# Altium project RFID_DACS-01.PrjPcb (part 3 of 3)

## Sheet 1.POWER.SchDoc: POWER
size A3; DrawnBy: AYTAC DILEK; SheetNumber: 1; SheetTotal: 16
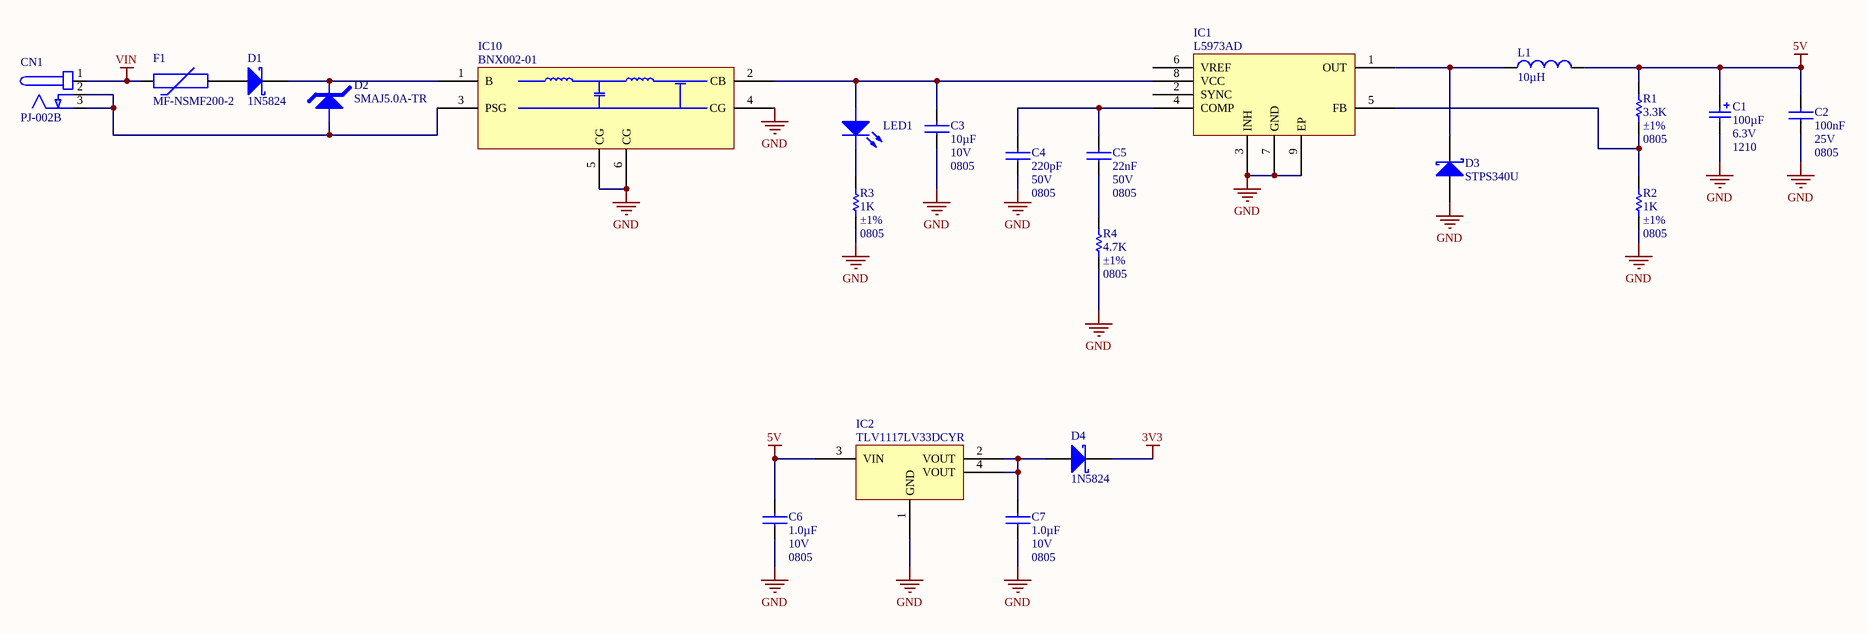
[diagram p10: 1.POWER.SchDoc]

### Parts
C1  Capacitance: 100µF  Voltage - Rated: 6.3V  Package / Case: 1210  [CAPMP3528X19N_EIA-1210_CASE-B]  (hidden comment: CAP_P)
C2  Capacitance: 100nF  Voltage - Rated: 25V  Package / Case: 0805  [CAPC2012X100N_EIA0805]  (hidden comment: CAP_NP)
C3  Capacitance: 10µF  Voltage - Rated: 10V  Package / Case: 0805  [CAPC2012X100N_EIA0805]  (hidden comment: CAP_NP)
C4  Capacitance: 220pF  Voltage - Rated: 50V  Package / Case: 0805  [CAPC2012X100N_EIA0805]  (hidden comment: CAP_NP)
C5  Capacitance: 22nF  Voltage - Rated: 50V  Package / Case: 0805  [CAPC2012X100N_EIA0805]  (hidden comment: CAP_NP)
C6  Capacitance: 1.0µF  Voltage - Rated: 10V  Package / Case: 0805  [CAPC2012X100N_EIA0805]  (hidden comment: CAP_NP)
C7  Capacitance: 1.0µF  Voltage - Rated: 10V  Package / Case: 0805  [CAPC2012X100N_EIA0805]  (hidden comment: CAP_NP)
CN1  Manufacturer Part Number: PJ-002B  [DC_JACK]  (hidden comment: DC_JACK)
D1  value 1N5824  [DIOM4436X24N_DO-214AA_SMB]  (hidden comment: DIODE_SCHOTTKY)
D2  value SMAJ5.0A-TR  [DIOM5126X26N_DO-214AC_SMA]  (hidden comment: DIODE_TVS_UNI)
D3  value STPS340U  [DIOM4436X24N_DO-214AA_SMB]  (hidden comment: DIODE_SCHOTTKY)
D4  value 1N5824  [DIOM4436X24N_DO-214AA_SMB]  (hidden comment: DIODE_SCHOTTKY)
F1  Manufacturer Part Number: MF-NSMF200-2  [FUSEC3216X16N]  (hidden comment: PTC)
IC1  L5973AD  [SOP127P600X200_HS-9N]
IC2  TLV1117LV33DCYR  [SOT230P700X180-4N_[TEXAS]R-PDSO-G4]
IC10  BNX002-01  [MURATA_BNX002-01]
L1  value 10µH  [TDK_SLF10145T-100M2R5-PF]  (hidden comment: INDUCTOR)
LED1  LED  [LEDC2012X70N_EIA0805_GREEN]  (value not drawn)
R1  value 3.3K  Tolerance: ±1%  Package / Case: 0805  [RESC2013X65N_EIA0805]  (hidden comment: RES)
R2  value 1K  Tolerance: ±1%  Package / Case: 0805  [RESC2013X65N_EIA0805]  (hidden comment: RES)
R3  value 1K  Tolerance: ±1%  Package / Case: 0805  [RESC2013X65N_EIA0805]  (hidden comment: RES)
R4  value 4.7K  Tolerance: ±1%  Package / Case: 0805  [RESC2013X65N_EIA0805]  (hidden comment: RES)

### Nets
3V3: D4.1
5V: C1.1 C2.2 C6.2 IC2.3(VIN) L1.2 R1.1
GND: C1.2 C2.1 C3.1 C4.1 C6.1 C7.1 D3.2 IC1.3(INH) IC1.7(GND) IC1.9(EP) IC2.1(GND) IC10.4(CG) IC10.5(CG) IC10.6(CG) R2.2 R3.2 R4.2
VIN: CN1.1(+) F1.1
NetC3_2: C3.2 IC1.8(VCC) IC10.2(CB) LED1.2
NetC4_2: C4.2 C5.2 IC1.4(COMP)
NetC5_1: C5.1 R4.1
NetC7_2: C7.2 D4.2 IC2.2(VOUT) IC2.4(VOUT)
NetCN1_2: CN1.2(GND) CN1.3(GND) D2.2 IC10.3(PSG)
NetD1_1: D1.1 D2.1 IC10.1(B)
NetD1_2: D1.2 F1.2
NetD3_1: D3.1 IC1.1(OUT) L1.1
NetIC1_5: IC1.5(FB) R1.2 R2.1
NetLED1_1: LED1.1 R3.1

Not connected (* = marked no-connect by the designer): IC1 2(SYNC) 6(VREF)

### Library data of the parts
C1 = SCAP01400007: CAP TANT 100UF 6.3V 20% 1210; Manufacturer: AVX Corporation; Manufacturer Part Number: TAJB107M006RNJ; ESR (Equivalent Series Resistance): 1.7 Ohm; Type: Molded; Cost x1 ($): 1.25000; Cost x10 ($): 1.02500; Cost x100 ($): 0.72500; Cost x1000 ($): 0.47500; Distrubutor: Digikey; Part Number: SCAP01400007; Value: 100uF; Tolerance: ±20%; Operating Temperature: -55°C ~ 125°C; Category: Capacitors; Family: Tantalum Capacitors; Distributor Part Number: 478-3877-1-ND; Distributor Link: http://www.digikey.com/product-detail/en/TAJB107M006RNJ/478-3877-1-ND/1126923; ROHS: YES; Quantity: 10
C2 = SCAP00300093: CAP CER 0.1UF 25V X7R 0805; Manufacturer: Samsung Electro-Mechanics America, Inc.; Manufacturer Part Number: CL21B104KACNNNC; Value: 100nF; Tolerance: ±10%; Type: Multi Layer Ceramic Capacitor  (MLCC); Cost x1 ($): 0.10000; Cost x10 ($): 0.03300; Cost x100 ($): 0.01470; Cost x1000 ($): 0.00825; Distrubutor: Digikey; Lead Time: 11 Weeks; Part Number: SCAP00300093; Temperature Coefficient: X7R; Operating Temperature: -55°C ~ 125°C; Mounting Type: Surface Mount, MLCC; Size / Dimension: 0.079" L x 0.049" W (2.00mm x 1.25mm); Category: Capacitors; Family: Ceramic Capacitors; Distributor Part Number: 1276-1099-1-ND; Distributor Link: http://www.digikey.com/product-detail/en/samsung-electro-mechanics-america-inc/CL21B104KACNNNC/1276-1099-1-ND/3889185; ROHS: YES; Moisture Sensitivity Level (MSL): 1 (Unlimited); Quantity: 50
C3 = SCAP00300106: CAP CER 10UF 10V X5R 0805; Manufacturer: Samsung Electro-Mechanics America, Inc; Manufacturer Part Number: CL21A106KPFNNNE; Tolerance: ±10%; Type: Multi Layer Ceramic Capacitor  (MLCC); Cost x1 ($): 0.18000; Cost x10 ($): 0.13000; Cost x100 ($): 0.06090; Cost x1000 ($): 0.03535; Distrubutor: Digikey; Lead Time: 11 Weeks; Part Number: SCAP00300106; Value: 10uF; Temperature Coefficient: X5R; Operating Temperature: -55°C ~ 85°C; Mounting Type: Surface Mount, MLCC; Size / Dimension: 0.079" L x 0.049" W (2.00mm x 1.25mm); Category: Capacitors; Family: Ceramic Capacitors; Distributor Part Number: 1276-1052-1-ND; Distributor Link: http://www.digikey.com/product-detail/en/samsung-electro-mechanics-america-inc/CL21A106KPFNNNE/1276-1052-1-ND/3889138; ROHS: YES; Moisture Sensitivity Level (MSL): 1 (Unlimited); Quantity: 50
C4 = SCAP00300066: CAP CER 220PF 50V X7R 0805; Manufacturer: Samsung Electro-Mechanics America, Inc.; Manufacturer Part Number: CL21B221KBANNNC; Tolerance: ±10%; Type: Multi Layer Ceramic Capacitor  (MLCC); Cost x1 ($): 0.10000; Cost x10 ($): 0.04700; Cost x100 ($): 0.02100; Cost x1000 ($): 0.01180; Distrubutor: Digikey; Lead Time: 11 Weeks; Part Number: SCAP00300066; Value: 220pF; Temperature Coefficient: X7R; Operating Temperature: -55°C ~ 125°C; Mounting Type: Surface Mount, MLCC; Size / Dimension: 0.079" L x 0.049" W (2.00mm x 1.25mm); Category: Capacitors; Family: Ceramic Capacitors; Distributor Part Number: 1276-2474-1-ND; Distributor Link: http://www.digikey.com/product-detail/en/samsung-electro-mechanics-america-inc/CL21B221KBANNNC/1276-2474-1-ND/3890560; ROHS: YES; Moisture Sensitivity Level (MSL): 1 (Unlimited); Quantity: 50
C5 = SCAP00300087: CAP CER 0.022UF 50V X7R 0805; Manufacturer: Samsung Electro-Mechanics America, Inc.; Manufacturer Part Number: CL21B223KBANNNC; Value: 22nF; Tolerance: ±10%; Type: Multi Layer Ceramic Capacitor  (MLCC); Cost x1 ($): 0.10000; Cost x10 ($): 0.05800; Cost x100 ($): 0.02600; Cost x1000 ($): 0.01458; Distrubutor: Digikey; Lead Time: 11 Weeks; Part Number: SCAP00300087; Temperature Coefficient: X7R; Operating Temperature: -55°C ~ 125°C; Mounting Type: Surface Mount, MLCC; Size / Dimension: 0.079" L x 0.049" W (2.00mm x 1.25mm); Category: Capacitors; Family: Ceramic Capacitors; Distributor Part Number: 1276-1081-1-ND; Distributor Link: http://www.digikey.com/product-detail/en/samsung-electro-mechanics-america-inc/CL21B223KBANNNC/1276-1081-1-ND/3889167; ROHS: YES; Moisture Sensitivity Level (MSL): 1 (Unlimited); Quantity: 50
C6 C7 = SCAP00300099: CAP CER 1UF 10V X7R 0805; Manufacturer: Samsung Electro-Mechanics America, Inc.; Manufacturer Part Number: CL21B105KPFNNNE; Value: 1.0uF; Tolerance: ±10%; Type: Multi Layer Ceramic Capacitor  (MLCC); Cost x1 ($): 0.10000; Cost x10 ($): 0.06100; Cost x100 ($): 0.02700; Cost x1000 ($): 0.01513; Distrubutor: Digikey; Lead Time: 11 Weeks; Part Number: SCAP00300099; Temperature Coefficient: X7R; Operating Temperature: -55°C ~ 125°C; Mounting Type: Surface Mount, MLCC; Size / Dimension: 0.079" L x 0.049" W (2.00mm x 1.25mm); Category: Capacitors; Family: Ceramic Capacitors; Distributor Part Number: 1276-1275-1-ND; Distributor Link: http://www.digikey.com/product-detail/en/samsung-electro-mechanics-america-inc/CL21B105KPFNNNE/1276-1275-1-ND/3889361; ROHS: YES; Moisture Sensitivity Level (MSL): 1 (Unlimited); Quantity: 50
CN1 = SCON00027: CONN POWER JACK MALE 2.5MM CLSD; Manufacturer: CUI Inc; Voltage: 24VDC; Current: 2.5A; Distrubutor: Digikey; Lead Time: 10 Weeks; Cost x1 ($): 0.93000; Cost x10 ($): 0.65100; Cost x100 ($): 0.43710; Cost x1000 ($): 0.31620; Part Number: SCON00027; Value: DC_JACK; Category: Connectors, Interconnects; Family: Barrel - Power Connectors; Connector Type: Jack; Contact Type: Male; Mounting Type: Through Hole, Right Angle; Packaging: Bulk; Contact Finish: Silver; Distributor Part Number: CP-002B-ND; Datasheet Link: http://www.digikey.com/product-detail/en/PJ-002B/CP-002B-ND/96965; ROHS: YES; Moisture Sensitivity Level (MSL): 1 (Unlimited); Part Status: Active; Quantity: 20
D1 D4 = SSEM00019: DIODE SCHOTTKY 5A 40V SMA; Manufacturer: Micro Commercial Co; Manufacturer Part Number: SK54B-LTP; Distrubutor: Digikey; Lead Time: 1 (Unlimited); Cost x10 ($): 0.42000; Cost x100 ($): 0.28840; Cost x1000 ($): 0.14832; Cost x1 ($): 0.54000; Part Number: SSEM00019; Category: Discrete Semiconductor Products; Family: Diodes - Rectifiers - Single; Package / Case: DO-214AA, SMB; Type: Schottky; Distributor Part Number: SK54B-LTPMSCT-ND; ROHS: YES; Datasheet Link: http://www.digikey.com/product-detail/en/micro-commercial-co/SK54B-LTP/SK54B-LTPMSCT-ND/5865087; Moisture Sensitivity Level (MSL): 8 Weeks; Quantity: 0
D2 = SCP00004: TVS DIODE 5VWM 13.4VC DO214AC; Manufacturer: STMicroelectronics; Voltage - Reverse Standoff (Typ): 5V; Voltage - Breakdown (Min): 6.4V; Power - Peak Pulse: 400W; Type: Zener; Cost x10 ($): 0.29600; Cost x100 ($): 0.18420; Cost x1000 ($): 0.09682; Distrubutor: Digikey; Lead Time: 11 Weeks; Cost x1 ($): 0.39000; Part Number: SCP00004; Category: Circuit Protection; Family: TVS - Diodes; Package / Case: DO-214AC, SMA; Manufacturer Part Number: SMAJ5.0A-TR; Distributor Part Number: 497-2999-1-ND; ROHS: YES; Datasheet Link: http://www.digikey.com/product-detail/en/stmicroelectronics/SMAJ5.0A-TR/497-2999-1-ND/634866; Moisture Sensitivity Level (MSL): 1 (Unlimited); Quantity: 0
D3 = SSEM00020: DIODE SCHOTTKY 40V 3A SMB; Manufacturer: STMicroelectronics; Cost x10 ($): 0.39500; Cost x100 ($): 0.29480; Cost x1000 ($): 0.17850; Distrubutor: Digikey; Lead Time: 1 (Unlimited); Cost x1 ($): 0.46000; Part Number: SSEM00020; Category: Discrete Semiconductor Products; Family: Diodes - Rectifiers - Single; Package / Case: DO-214AA, SMB; Type: Schottky; Manufacturer Part Number: STPS340U; Distributor Part Number: 497-2465-1-ND; ROHS: YES; Datasheet Link: http://www.digikey.com/product-detail/en/stmicroelectronics/STPS340U/497-2465-1-ND/603847; Part Status: Active; Quantity: 0
F1 = SCP00008: FUSE RESETTABLE 2.0A HOLD SMD; Manufacturer: Bourns Inc.; Value: MF-NSMF200-2; Cost x10 ($): 0.56100; Cost x100 ($): 0.39270; Cost x1000 ($): 0.26690; Distrubutor: Digikey; Lead Time: 10 Weeks; Cost x1 ($): 0.60000; Part Number: SCP00008; Category: Circuit Protection; Family: PTC Resettable Fuses; Package / Case: 1206 (3216 Metric), Concave, Long Side Terminals; Distributor Part Number: MF-NSMF200-2CT-ND; ROHS: YES; Datasheet Link: http://www.digikey.com/product-detail/en/bourns-inc/MF-NSMF200-2/MF-NSMF200-2CT-ND/1232791; Moisture Sensitivity Level (MSL): 1 (Unlimited); Quantity: 100; Part Status: Active
IC1 = SIC00116: IC REG BUCK ADJ 2A 8SOIC; Manufacturer: STMicroelectronics; Vin: 4 V ~ 36 V; Speed: 500kHz; Cost x10 ($): 1.98800; Cost x100 ($): 1.59750; Cost x1000 ($): 1.08750; Distrubutor: Digikey; Lead Time: 12 Weeks; Cost x1 ($): 2.21000; Part Number: SIC00116; Manufacturer Part Number: L5973AD; Value: L5973AD; Iout: 2A; Operating Temperature: -40°C ~ 150°C (TJ); Category: Integrated Circuits (ICs); Family: PMIC - Voltage Regulators - DC DC Switching Regulators; Package / Case: 8-SOIC (0.154", 3.90mm Width) Exposed Pad; Type: Buck; Distributor Part Number: 497-4565-5-ND; ROHS: YES; Distributor Link: http://www.digikey.com/product-detail/en/stmicroelectronics/L5973AD/497-4565-5-ND/585938; MSL: 3 (168 Hours); Quantity: 0
IC2 = SIC00137: IC REG LDO 3.3V 1A SOT223; Manufacturer: Texas Instruments; Vin: Up to 5.5V; Iout: 1.1A; Cost x10 ($): 0.56400; Cost x100 ($): 0.43160; Cost x1000 ($): 0.27390; Distrubutor: Digikey; Lead Time: 6 Weeks; Cost x1 ($): 0.64000; Part Number: SIC00137; Manufacturer Part Number: TLV1117LV33DCYR; Value: TLV1117LV33DCYR; Vout: 3.3V; Operating Temperature: -40°C ~ 125°C; Category: Integrated Circuits (ICs); Family: PMIC - Voltage Regulators - Linear; Package / Case: SOT-223-4, TO-261-4, TO-261AA; Type: Positive Fixed; Distributor Part Number: 296-28778-1-ND; ROHS: YES; Distributor Link: http://www.digikey.com/product-detail/en/texas-instruments/TLV1117LV33DCYR/296-28778-1-ND/2666520; MSL: 1 (Unlimited); Quantity: 0
IC10 = SFIL00006: FILTER LC TH; Manufacturer: Murata Electronics North America; Current Rating: 10A; Value: LC_FILTER; Cost x10 ($): 7.62800; Cost x100 ($): 4.91550; Cost x1000 ($): 4.23750; Distrubutor: Digikey; Lead Time: 7 Weeks; Cost x1 ($): 8.48000; Part Number: SFIL00006; Type: Low Pass; Package / Case: Block, 4 Lead; Category: Filters; Family: EMI/RFI Filters (LC, RC Networks); Manufacturer Part Number: BNX002-01; Distributor Part Number: 490-5053-ND; ROHS: YES; Datasheet Link: http://www.digikey.com/product-detail/en/murata-electronics-north-america/BNX002-01/490-5053-ND/1825574; Quantity: 0
L1 = SIND00006: FIXED IND 10UH 2.5A 43.7 MOHM; Manufacturer: TDK Corporation; Manufacturer Part Number: SLF10145T-100M2R5-PF; Tolerance: ±20%; DC Resistance (DCR): 43.7 mOhm Max; Type: Wirewound; Cost x10 ($): 1.12500; Cost x100 ($): 0.85500; Distrubutor: Digikey; Lead Time: 14 Weeks; Cost x1 ($): 1.20000; Part Number: SIND00006; Inductance: 10µH; Package / Case: Nonstandard; Operating Temperature: -40°C ~ 105°C; Current Rating: 2.5A; Category: Inductors, Coils, Chokes; Family: Fixed Inductors; Cost x1000 ($): 0.85500; Distributor Part Number: 445-1975-1-ND; Distributor Link: http://www.digikey.com/product-detail/en/tdk-corporation/SLF10145T-100M2R5-PF/445-1975-1-ND/755382; ROHS: YES; Moisture Sensitivity Level (MSL): 1 (Unlimited); Quantity: 0
LED1 = SOPT00002: LED GREEN CLEAR THIN 0805 SMD; Manufacturer: Lite-On Inc; Manufacturer Part Number: LTST-C171KGKT; Value: LED_GREEN; Cost x10 ($): 0.24800; Cost x100 ($): 0.13500; Cost x1000 ($): 0.05850; Distrubutor: Digikey; Cost x1 ($): 0.32000; Part Number: SOPT00002; Package / Case: 0805 (2012 Metric); Category: Optoelectronics; Family: LED Indication - Discrete; Type: LED; Distributor Part Number: 160-1426-1-ND; ROHS: YES; Datasheet Link: http://www.digikey.com/product-detail/en/LTST-C171KGKT/160-1426-1-ND/386798; Quantity: 124
R1 = SRES03010086: RES SMD 3.3K OHM 1% 1/8W 0805; Manufacturer: Yageo; Manufacturer Part Number: RC0805FR-073K3L; Power (Watts): 0.125W, 1/8W; Cost x1 ($): 0.10; Cost x10 ($): 0.21; Cost x100 ($): 0.84; Cost x1000 ($): 3.79; Distrubutor: Digikey; Part Number: SRES03010086; Resistance (Ohm): 3.3K; Category: Resistors; Family: Chip Resistor - Surface Mount; Distributor Part Number: 311-3.30KCRCT-ND; Distributor Link: http://www.digikey.com/product-detail/en/RC0805FR-073K3L/311-3.30KCRCT-ND/730760; ROHS: YES; Quantity: 0
R2 R3 = SRES03010074: RES SMD 1K OHM 1% 1/8W 0805; Manufacturer: Yageo; Manufacturer Part Number: RC0805FR-071KL; Power (Watts): 0.125W, 1/8W; Cost x1 ($): 0.10; Cost x10 ($): 0.21; Cost x100 ($): 0.84; Cost x1000 ($): 3.79; Distrubutor: Digikey; Part Number: SRES03010074; Resistance (Ohm): 1K; Category: Resistors; Family: Chip Resistor - Surface Mount; Distributor Part Number: 311-1.00KCRCT-ND; Distributor Link: http://www.digikey.com/product-detail/en/RC0805FR-071KL/311-1.00KCRCT-ND/730391; ROHS: YES; Quantity: 0
R4 = SRES03010090: RES SMD 4.7K OHM 1% 1/8W 0805; Manufacturer: Yageo; Manufacturer Part Number: RC0805FR-074K7L; Power (Watts): 0.125W, 1/8W; Cost x1 ($): 0.10; Cost x10 ($): 0.21; Cost x100 ($): 0.84; Cost x1000 ($): 3.79; Distrubutor: Digikey; Part Number: SRES03010090; Resistance (Ohm): 4.7K; Category: Resistors; Family: Chip Resistor - Surface Mount; Distributor Part Number: 311-4.70KCRCT-ND; Distributor Link: http://www.digikey.com/product-detail/en/RC0805FR-074K7L/311-4.70KCRCT-ND/730876; ROHS: YES; Quantity: 0

## Sheet 10.RELAY.SchDoc: RELAY
size A; SheetNumber: 10; SheetTotal: 16
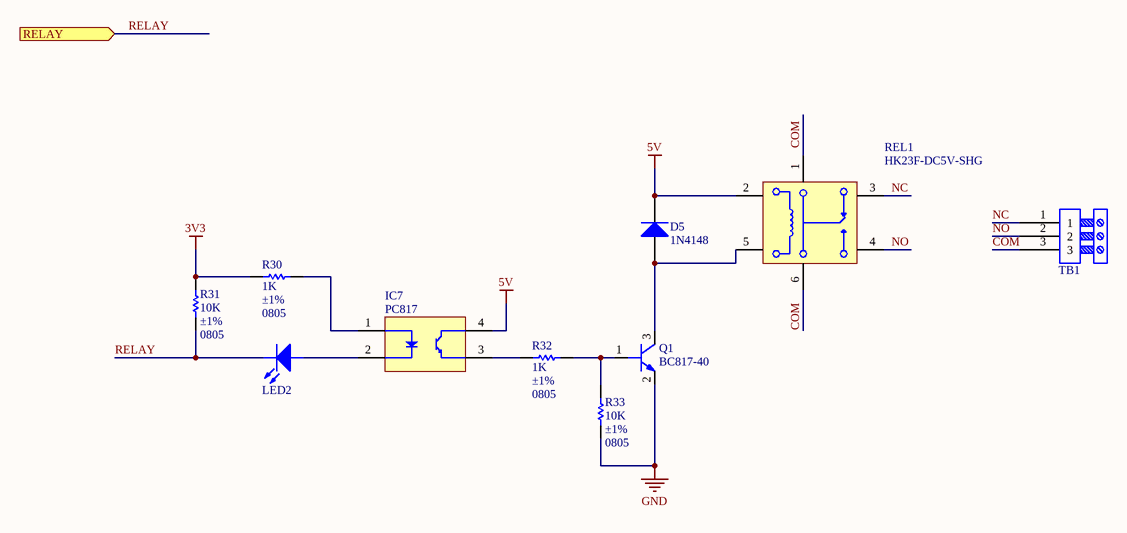
[diagram p11: 10.RELAY.SchDoc]

### Parts
D5  value 1N4148  [SOD323]  (hidden comment: DIODE)
IC7  PC817  [SMD-4]
LED2  LED  [LEDC2012X70N_EIA0805_RED]  (value not drawn)
Q1  value BC817-40  [SOT95P230X110-3N_SOT-23]  (hidden comment: BC817)
R30  value 1K  Tolerance: ±1%  Package / Case: 0805  [RESC2013X65N_EIA0805]  (hidden comment: RES)
R31  value 10K  Tolerance: ±1%  Package / Case: 0805  [RESC2013X65N_EIA0805]  (hidden comment: RES)
R32  value 1K  Tolerance: ±1%  Package / Case: 0805  [RESC2013X65N_EIA0805]  (hidden comment: RES)
R33  value 10K  Tolerance: ±1%  Package / Case: 0805  [RESC2013X65N_EIA0805]  (hidden comment: RES)
REL1  HK23F-DC5V-SHG  [HUIKE_HK23F-DC5V-SHG]
TB1  TB3_EURO  [TB3_EURO]  (value not drawn)

### Ports
RELAY (in)

### Nets
3V3: R30.1 R31.1
5V: D5.1(K) IC7.4 REL1.2
GND: Q1.2(E) R33.2
COM: REL1.1 REL1.6 TB1.3
NC: REL1.3 TB1.1
NO: REL1.4 TB1.2
RELAY: LED2.1 R31.2 ; port RELAY
NetD5_2: D5.2(A) Q1.3(C) REL1.5
NetIC7_1: IC7.1 R30.2
NetIC7_2: IC7.2 LED2.2
NetIC7_3: IC7.3 R32.2
NetQ1_1: Q1.1(B) R32.1 R33.1

### Library data of the parts
D5 = SSEM00021: DIODE GEN PURP 75V 150MA SOD323; Manufacturer: Diodes Incorporated; Manufacturer Part Number: 1N4148WS-7-F; Type: Standard; Cost x10 ($): 0.15500; Cost x100 ($): 0.08480; Cost x1000 ($): 0.03554; Distrubutor: Digikey; Lead Time: 1 (Unlimited); Cost x1 ($): 0.17000; Part Number: SSEM00021; Voltage: 75V; Category: Discrete Semiconductor Products; Family: Diodes - Rectifiers - Single; Package / Case: SC-76, SOD-323; Distributor Part Number: 1N4148WS-FDICT-ND; ROHS: YES; Datasheet Link: http://www.digikey.com/product-detail/en/diodes-incorporated/1N4148WS-7-F/1N4148WS-FDICT-ND/815281; Moisture Sensitivity Level (MSL): 6 Weeks; Part Status: Active; Quantity: 0
IC7 = SISO00004: OPTOISOLTR 5KV TRANSISTOR 4-SMD; Manufacturer: Everlight Electronics Co Ltd; Manufacturer Part Number: EL817(S)(C)(TD)-G; Voltage - Isolation: 5000Vrms; Cost x10 ($): 0.11100; Distrubutor: Digikey; Lead Time: 12 Weeks; Part Number: SISO00004; Value: PC817; Category: Isolators; Family: Optoisolators - Transistor, Photovoltaic Output; Package / Case: 4-SMD, Gull Wing; Type: General Purpose; Cost x100 ($): 0.11100; Cost x1000 ($): 0.11100; Distributor Part Number: EL817(S)(C)(TD)-G-ND; ROHS: YES; Distributor Link: http://www.digikey.com/product-detail/en/everlight-electronics-co-ltd/EL817(S)(C)(TD)-G/EL817(S)(C)(TD)-G-ND/2693421; Quantity: 0; Cost x1 ($): 0.11100
LED2 = SOPT00004: LED SUPER RED CLR THIN 0805 SMD; Manufacturer: Lite-On Inc; Manufacturer Part Number: LTST-C171KRKT; Value: LED_RED; Cost x10 ($): 0.24800; Cost x100 ($): 0.13500; Cost x1000 ($): 0.05850; Distrubutor: Digikey; Cost x1 ($): 0.32000; Part Number: SOPT00004; Package / Case: 0805 (2012 Metric); Category: Optoelectronics; Family: LED Indication - Discrete; Type: LED; Distributor Part Number: 160-1427-1-ND; ROHS: YES; Datasheet Link: http://www.digikey.com/product-detail/en/LTST-C171KRKT/160-1427-1-ND/386800; Quantity: 110
Q1 = STRANS00034: TRANS NPN 45V 0.5A SOT23; Manufacturer: NXP Semiconductors; Manufacturer Part Number: BC817-40,215; Ic (Max): 500mA; Vce Saturation (Max) @ Ib, Ic: 700mV @ 50mA, 500mA; Ic Cutoff (Max): 100nA (ICBO); hFE (Min) @ Ic, Vce: 250 @ 100mA, 1V; Power - Max: 250mW; Frequency - Transition: 100MHz; Cost x10 ($): 0.12700; Cost x100 ($): 0.06930; Cost x1000 ($): 0.02905; Distrubutor: Digikey; Lead Time: 6 Weeks; Cost x1 ($): 0.14000; Part Number: STRANS00034; Vce Breakdown (Max): 45V; Mounting Type: SMD; Category: Discrete Semiconductor Products; Family: Transistors (BJT) - Single; Transistor Type: NPN; Package / Case: SOT-23-3, TO-236-3, SC-59; Distributor Part Number: 568-1631-1-ND; ROHS: YES; Datasheet Link: http://www.digikey.com/product-detail/en/nxp-semiconductors/BC817-40,215/568-1631-1-ND/763458; Quantity: 110
R30 R32 = SRES03010074: as R2 on sheet 1.POWER; Part Number: SRES03010074; Resistance (Ohm): 1K; Category: Resistors; Family: Chip Resistor - Surface Mount; Distributor Part Number: 311-1.00KCRCT-ND; Distributor Link: http://www.digikey.com/product-detail/en/RC0805FR-071KL/311-1.00KCRCT-ND/730391; ROHS: YES; Quantity: 0
R31 R33 = SRES03010098: RES SMD 10K OHM 1% 1/8W 0805; Manufacturer: Yageo; Manufacturer Part Number: RC0805FR-0710KL; Power (Watts): 0.125W, 1/8W; Cost x1 ($): 0.10; Cost x10 ($): 0.21; Cost x100 ($): 0.84; Cost x1000 ($): 3.79; Distrubutor: Digikey; Part Number: SRES03010098; Resistance (Ohm): 10K; Category: Resistors; Family: Chip Resistor - Surface Mount; Distributor Part Number: 311-10.0KCRCT-ND; Distributor Link: http://www.digikey.com/product-detail/en/RC0805FR-0710KL/311-10.0KCRCT-ND/730482; ROHS: YES; Quantity: 0
REL1 = SREL00004: RELAY GEN PURPOSE SPDT 3A 5V; Coil Voltage: 5VDC; Contact Rating (Current): 2A@120VAC/2A@24VDC; Contact Form: SPDT (1 Form C); Part Number: SREL00004; Value: HK23F-DC5V-SHG; Operating Temperature: -30°C ~ 70°C; Type: General Purpose; Category: Relays; Family: Signal Relays, Up to 3 Amps; Mounting Type: Through Hole
TB1 = SCON00134: TERM BLOCK HDR 3POS VERT 3.81MM; Manufacturer: On Shore Technology Inc.; Manufacturer Part Number: EDSTLZ1550/3; Value: TB3-HDR; Pitch: 0.150" (3.81mm); Connector Type: Header, Male Pins, Shrouded (4 Side); Cost x1 ($): 1.15000; Cost x10 ($): 1.01000; Cost x100 ($): 0.87120; Cost x1000 ($): 0.63360; Distrubutor: Digikey; Lead Time: 8 Weeks; Part Number: SCON00134; Category: Connectors, Interconnects; Family: Terminal Blocks - Headers, Plugs and Sockets; Mounting Type: Through Hole; Distributor Part Number: ED1935-ND; Datasheet Link: http://www.digikey.com/product-detail/en/on-shore-technology-inc/EDSTLZ1550-3/ED1935-ND/250542; ROHS: YES; Moisture Sensitivity Level (MSL): 1 (Unlimited); Part Status: Active; Quantity: 0

## Sheet 14.BUZZER.SchDoc: BUZZER
size A; SheetNumber: 14; SheetTotal: 16
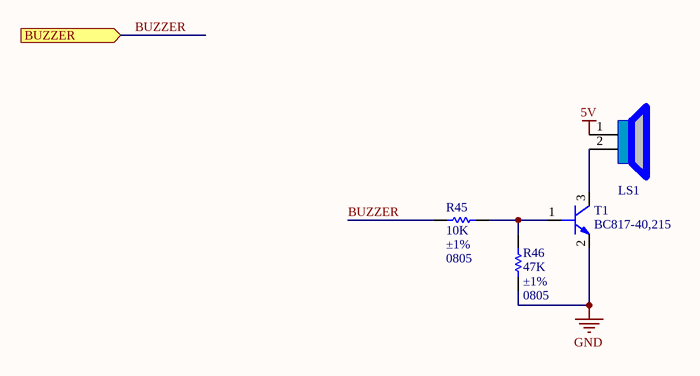
[diagram p12: 14.BUZZER.SchDoc]

### Parts
LS1  BUZZER  [BUZZER_12MM]  (value not drawn)
R45  Resistance (Ohm): 10K  Tolerance: ±1%  Package / Case: 0805  [RESC2013X65N_EIA0805]  (hidden comment: RES)
R46  Resistance (Ohm): 47K  Tolerance: ±1%  Package / Case: 0805  [RESC2013X65N_EIA0805]  (hidden comment: RES)
T1  Manufacturer Part Number: BC817-40,215  [SOT95P240X120-3N_SOT-23-3]  (hidden comment: BC817-40)

### Ports
BUZZER (in)

### Nets
5V: LS1.1(+)
GND: R46.1 T1.2(E)
BUZZER: R45.1 ; port BUZZER
NetLS1_2: LS1.2(-) T1.3(C)
NetR45_2: R45.2 R46.2 T1.1(B)

### Library data of the parts
LS1 = SAUD00001: AUDIO MAGNETIC INDICATOR 4-7V TH; Manufacturer: CUI Inc.; Manufacturer Part Number: CEM-1205C; Voltage: 5VDC; Iin: 35mA; Frequency: 2.3kHz; Cost x10 ($): 2.08200; Cost x100 ($): 1.54200; Cost x1000 ($): 1.11795; Distrubutor: Digikey; Lead Time: 13 Weeks; Cost x1 ($): 2.51000; Part Number: SAUD00001; Value: BUZZER; Size / Dimension: 12.0mm Dia x 10.0mm H; Category: Audio Products; Family: Buzzers; Type: Indicator, Internally Driven; Distributor Part Number: 102-1124-ND; ROHS: YES; Datasheet Link: http://www.digikey.com/product-detail/en/cui-inc/CEM-1205C/102-1124-ND/412383; Moisture Sensitivity Level (MSL): 1 (Unlimited); Quantity: 20; Active: Active
R45 = SRES03010098: as R31 on sheet 10.RELAY; Part Number: SRES03010098; Value: 10K; Category: Resistors; Family: Chip Resistor - Surface Mount; Distributor Part Number: 311-10.0KCRCT-ND; Distributor Link: http://www.digikey.com/product-detail/en/RC0805FR-0710KL/311-10.0KCRCT-ND/730482; ROHS: YES; Quantity: 0
R46 = SRES03010114: RES SMD 47K OHM 1% 1/8W 0805; Manufacturer: Yageo; Manufacturer Part Number: RC0805FR-0747KL; Power (Watts): 0.125W, 1/8W; Cost x1 ($): 0.10; Cost x10 ($): 0.21; Cost x100 ($): 0.84; Cost x1000 ($): 3.79; Distrubutor: Digikey; Part Number: SRES03010114; Value: 47K; Category: Resistors; Family: Chip Resistor - Surface Mount; Distributor Part Number: 311-47.0KCRCT-ND; Distributor Link: http://www.digikey.com/product-detail/en/RC0805FR-0747KL/311-47.0KCRCT-ND/730920; ROHS: YES; Quantity: 0
T1 = SSEM00025: TRANS NPN 45V 0.5A SOT23; Manufacturer: NXP Semiconductors; Cost x10 ($): 0.12700; Cost x100 ($): 0.06930; Cost x1000 ($): 0.02905; Distrubutor: Digikey; Lead Time: 6 Weeks; Cost x1 ($): 0.14000; Part Number: SSEM00025; Value: BC817-40; Category: Discrete Semiconductor Products; Family: Transistors - Bipolar (BJT) - Single; Package / Case: TO-236-3, SC-59, SOT-23-3; Type: NPN; Distributor Part Number: 568-1631-1-ND; ROHS: YES; Datasheet Link: http://www.digikey.com/product-detail/en/nxp-semiconductors/BC817-40,215/568-1631-1-ND/763458; Moisture Sensitivity Level (MSL): 1 (Unlimited); Part Status: Active; Quantity: 100

## Sheet 15.RS485.SchDoc: RS485
size A; SheetNumber: 15; SheetTotal: 16
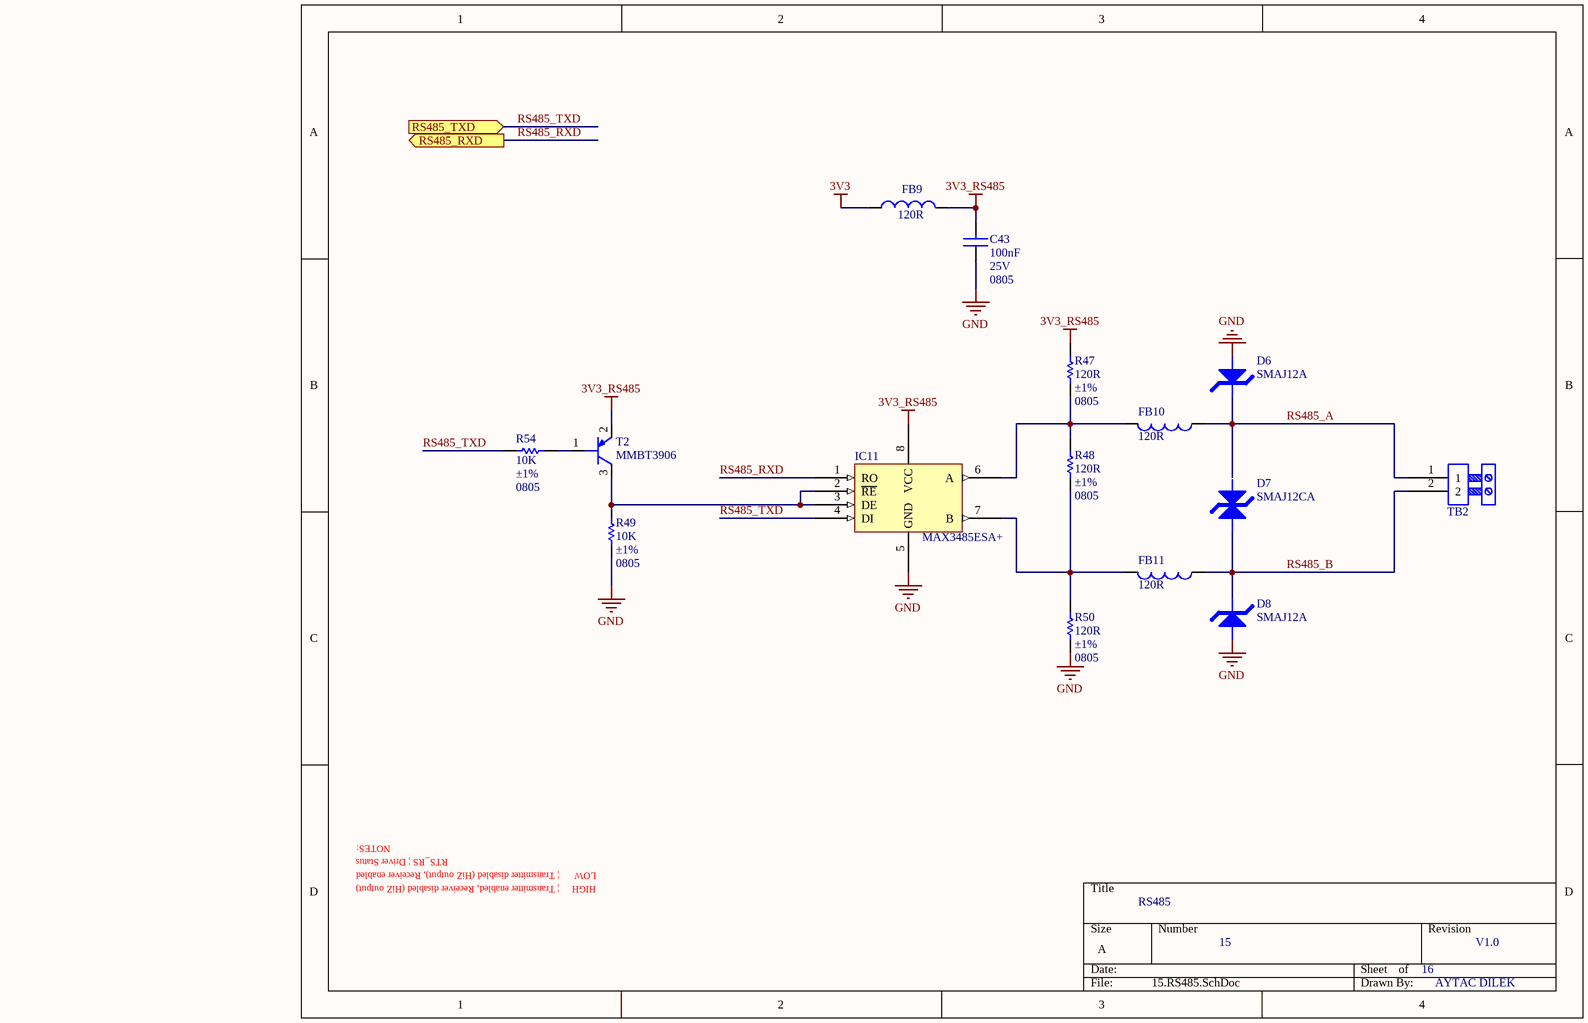
[diagram p13: 15.RS485.SchDoc]

### Parts
C43  Capacitance: 100nF  Voltage - Rated: 25V  Package / Case: 0805  [CAPC2012X100N_EIA0805]  (hidden comment: CAP_NP)
D6  value SMAJ12A  [DIOM5126X26N_DO-214AC_SMA]  (hidden comment: DIODE_TVS_UNI)
D7  value SMAJ12CA  [DIOM5126X26N_DO-214AC_SMA]  (hidden comment: DIODE_TVS_BI)
D8  value SMAJ12A  [DIOM5126X26N_DO-214AC_SMA]  (hidden comment: DIODE_TVS_UNI)
FB9  Impedance: 120R  [FILC2012X100N_EIA0805]  (hidden comment: BEAD)
FB10  Impedance: 120R  [FILC2012X100N_EIA0805]  (hidden comment: BEAD)
FB11  Impedance: 120R  [FILC2012X100N_EIA0805]  (hidden comment: BEAD)
IC11  Manufacturer Part Number: MAX3485ESA+  [SOIC127P600X175-8N]  (hidden comment: MAX3485)
R47  value 120R  Tolerance: ±1%  Package / Case: 0805  [RESC2013X65N_EIA0805]  (hidden comment: RES)
R48  value 120R  Tolerance: ±1%  Package / Case: 0805  [RESC2013X65N_EIA0805]  (hidden comment: RES)
R49  value 10K  Tolerance: ±1%  Package / Case: 0805  [RESC2013X65N_EIA0805]  (hidden comment: RES)
R50  value 120R  Tolerance: ±1%  Package / Case: 0805  [RESC2013X65N_EIA0805]  (hidden comment: RES)
R54  value 10K  Tolerance: ±1%  Package / Case: 0805  [RESC2013X65N_EIA0805]  (hidden comment: RES)
T2  MMBT3906  [SOT95P240X120-3N_SOT-23-3]
TB2  TB2_EURO  [TB2_EURO]  (value not drawn)

### Ports
RS485_RXD (out), RS485_TXD (in)

### Nets
3V3: FB9.1
3V3_RS485: C43.2 FB9.2 IC11.8(VCC) R47.1 T2.2(E)
GND: C43.1 D6.2 D8.2 IC11.5(GND) R49.2 R50.2
RS485_A: D6.1 D7.1 FB10.1 TB2.1
RS485_B: D7.2 D8.1 FB11.1 TB2.2
RS485_RXD: IC11.1(RO) ; port RS485_RXD
RS485_TXD: IC11.4(DI) R54.1 ; port RS485_TXD
NetFB10_2: FB10.2 IC11.6(A) R47.2 R48.1
NetFB11_2: FB11.2 IC11.7(B) R48.2 R50.1
NetIC11_2: IC11.2(~{RE}) IC11.3(DE) R49.1 T2.3(C)
NetR54_2: R54.2 T2.1(B)

### Notes on the sheet
- NOTES:
- RTS_RS | Driver Status
- LOW      | Transmitter disabled (HiZ output), Receiver enabled
- HIGH     | Transmitter enabled, Receiver disabled (HiZ output)

### Library data of the parts
C43 = SCAP00300093: as C2 on sheet 1.POWER; Part Number: SCAP00300093; Temperature Coefficient: X7R; Operating Temperature: -55°C ~ 125°C; Mounting Type: Surface Mount, MLCC; Size / Dimension: 0.079" L x 0.049" W (2.00mm x 1.25mm); Category: Capacitors; Family: Ceramic Capacitors; Distributor Part Number: 1276-1099-1-ND; Distributor Link: http://www.digikey.com/product-detail/en/samsung-electro-mechanics-america-inc/CL21B104KACNNNC/1276-1099-1-ND/3889185; ROHS: YES; Moisture Sensitivity Level (MSL): 1 (Unlimited); Quantity: 50
D6 D8 = SCP00005: TVS DIODE 12VWM 19.9VC SMA; Manufacturer: Littelfuse Inc.; Voltage - Reverse Standoff (Typ): 12V; Voltage - Breakdown (Min): 13.3V; Type: Zener; Cost x10 ($): 0.36000; Cost x100 ($): 0.27010; Cost x1000 ($): 0.15295; Distrubutor: Digikey; Lead Time: 10 Weeks; Cost x1 ($): 0.43000; Part Number: SCP00005; Category: Circuit Protection; Family: TVS - Diodes; Package / Case: DO-214AC, SMA; Manufacturer Part Number: SMAJ12A; Distributor Part Number: SMAJ12ALFCT-ND; ROHS: YES; Datasheet Link: http://www.digikey.com/product-detail/en/littelfuse-inc/SMAJ12A/SMAJ12ALFCT-ND/762482; Moisture Sensitivity Level (MSL): 1 (Unlimited); Quantity: 0; Part Status: Active
D7 = SCP00006: TVS DIODE 12VWM 19.9VC SMA; Manufacturer: Littelfuse Inc.; Voltage - Reverse Standoff (Typ): 12V; Voltage - Breakdown (Min): 13.3V; Type: Zener; Cost x10 ($): 0.39900; Cost x100 ($): 0.29940; Cost x1000 ($): 0.16958; Distrubutor: Digikey; Lead Time: 9 Weeks; Cost x1 ($): 0.47000; Part Number: SCP00006; Category: Circuit Protection; Family: TVS - Diodes; Package / Case: DO-214AC, SMA; Manufacturer Part Number: SMAJ12CA; Distributor Part Number: SMAJ12CALFCT-ND; ROHS: YES; Datasheet Link: http://www.digikey.com/product-detail/en/littelfuse-inc/SMAJ12CA/SMAJ12CALFCT-ND/762483; Moisture Sensitivity Level (MSL): 1 (Unlimited); Quantity: 0; Part Status: Active
FB9-FB11 = SFIL00005: FERRITE CHIP POWER 120 OHM SMD; Manufacturer: Laird-Signal Integrity Products; Manufacturer Part Number: HI0805O121R-10; Type: Differential Mode - Single; Current Rating: 3.5A; DC Resistance (DCR): 20 mOhm Max; Cost x10 ($): 0.08700; Cost x100 ($): 0.05230; Cost x1000 ($): 0.03010; Distrubutor: Digikey; Cost x1 ($): 0.10000; Part Number: SFIL00005; Package / Case: 0805 (2012 Metric); Value: BEAD; Category: Filters; Family: Ferrite Beads and Chips; Distributor Part Number: 240-2393-1-ND; ROHS: YES; Datasheet Link: http://www.digikey.com/product-detail/en/HI0805O121R-10/240-2393-1-ND/806753; Quantity: 50
IC11 = SIC00035: IC TXRX RS485/422 10MBPS 8SOIC; Manufacturer: Maxim Integrated; Vin: 3 V ~ 3.6 V; Protocol: RS422, RS485; Cost x10 ($): 3.24900; Cost x100 ($): 2.93260; Distrubutor: Digikey; Lead Time: 6 Weeks; Cost x1 ($): 3.42000; Part Number: SIC00035; Value: MAX3485; Speed: 10Mbps; Operating Temperature: -40°C ~ 85°C; Category: Integrated Circuits (ICs); Family: Interface - Drivers, Receivers, Transceivers; Package / Case: 8-SOIC (0.154", 3.90mm Width); Type: Transceiver; Cost x1000 ($): 2.93260; Distributor Part Number: MAX3485ESA+-ND; ROHS: YES; Distributor Link: http://www.digikey.com/product-detail/en/maxim-integrated/MAX3485ESA-/MAX3485ESA--ND/1702240; MSL: 1 (Unlimited); Quantity: 10
R47 R48 R50 = SRES03010052: RES SMD 120 OHM 1% 1/8W 0805; Manufacturer: Yageo; Manufacturer Part Number: RC0805FR-07120RL; Resistance (Ohm): 120; Power (Watts): 0.125W, 1/8W; Cost x1 ($): 0.10; Cost x10 ($): 0.21; Cost x100 ($): 0.84; Cost x1000 ($): 3.79; Distrubutor: Digikey; Part Number: SRES03010052; Category: Resistors; Family: Chip Resistor - Surface Mount; Distributor Part Number: 311-120CRCT-ND; Distributor Link: http://www.digikey.com/product-detail/en/RC0805FR-07120RL/311-120CRCT-ND/730522; ROHS: YES; Quantity: 0
R49 R54 = SRES03010098: as R31 on sheet 10.RELAY; Part Number: SRES03010098; Resistance (Ohm): 10K; Category: Resistors; Family: Chip Resistor - Surface Mount; Distributor Part Number: 311-10.0KCRCT-ND; Distributor Link: http://www.digikey.com/product-detail/en/RC0805FR-0710KL/311-10.0KCRCT-ND/730482; ROHS: YES; Quantity: 0
T2 = SSEM00023: TRANS PNP 40V 0.2A SOT-23; Manufacturer: Fairchild Semiconductor; Cost x10 ($): 0.18700; Cost x100 ($): 0.10170; Cost x1000 ($): 0.04264; Distrubutor: Digikey; Lead Time: 6 Weeks; Cost x1 ($): 0.20000; Part Number: SSEM00023; Value: MMBT3906; Category: Discrete Semiconductor Products; Family: Transistors - Bipolar (BJT) - Single; Package / Case: TO-236-3, SC-59, SOT-23-3; Type: PNP; Manufacturer Part Number: MMBT3906; Distributor Part Number: MMBT3906FSCT-ND; ROHS: YES; Datasheet Link: http://www.digikey.com/product-detail/en/MMBT3906/MMBT3906FSCT-ND/458972; Moisture Sensitivity Level (MSL): 1 (Unlimited); Part Status: Active; Quantity: 100
TB2 = SCON00138: TERM BLOCK HDR 2POS VERT 3.81MM; Manufacturer: On Shore Technology Inc.; Manufacturer Part Number: EDSTLZ1550/2; Value: TB2-HDR; Pitch: 0.150" (3.81mm); Connector Type: Header, Male Pins, Shrouded (4 Side); Cost x1 ($): 0.76000; Cost x10 ($): 0.67100; Cost x100 ($): 0.57860; Cost x1000 ($): 0.42080; Distrubutor: Digikey; Lead Time: 8 Weeks; Part Number: SCON00138; Category: Connectors, Interconnects; Family: Terminal Blocks - Headers, Plugs and Sockets; Mounting Type: Through Hole; Distributor Part Number: ED1934-ND; Datasheet Link: http://www.digikey.com/product-detail/en/on-shore-technology-inc/EDSTLZ1550-2/ED1934-ND/250541; ROHS: YES; Moisture Sensitivity Level (MSL): 1 (Unlimited); Part Status: Active; Quantity: 0

## Sheet 5.WIFI.SchDoc: WIFI
size A; SheetNumber: 5; SheetTotal: 16

## Sheet 0.COVER.SchDoc: COVER
size A3; SheetNumber: 0; SheetTotal: 16
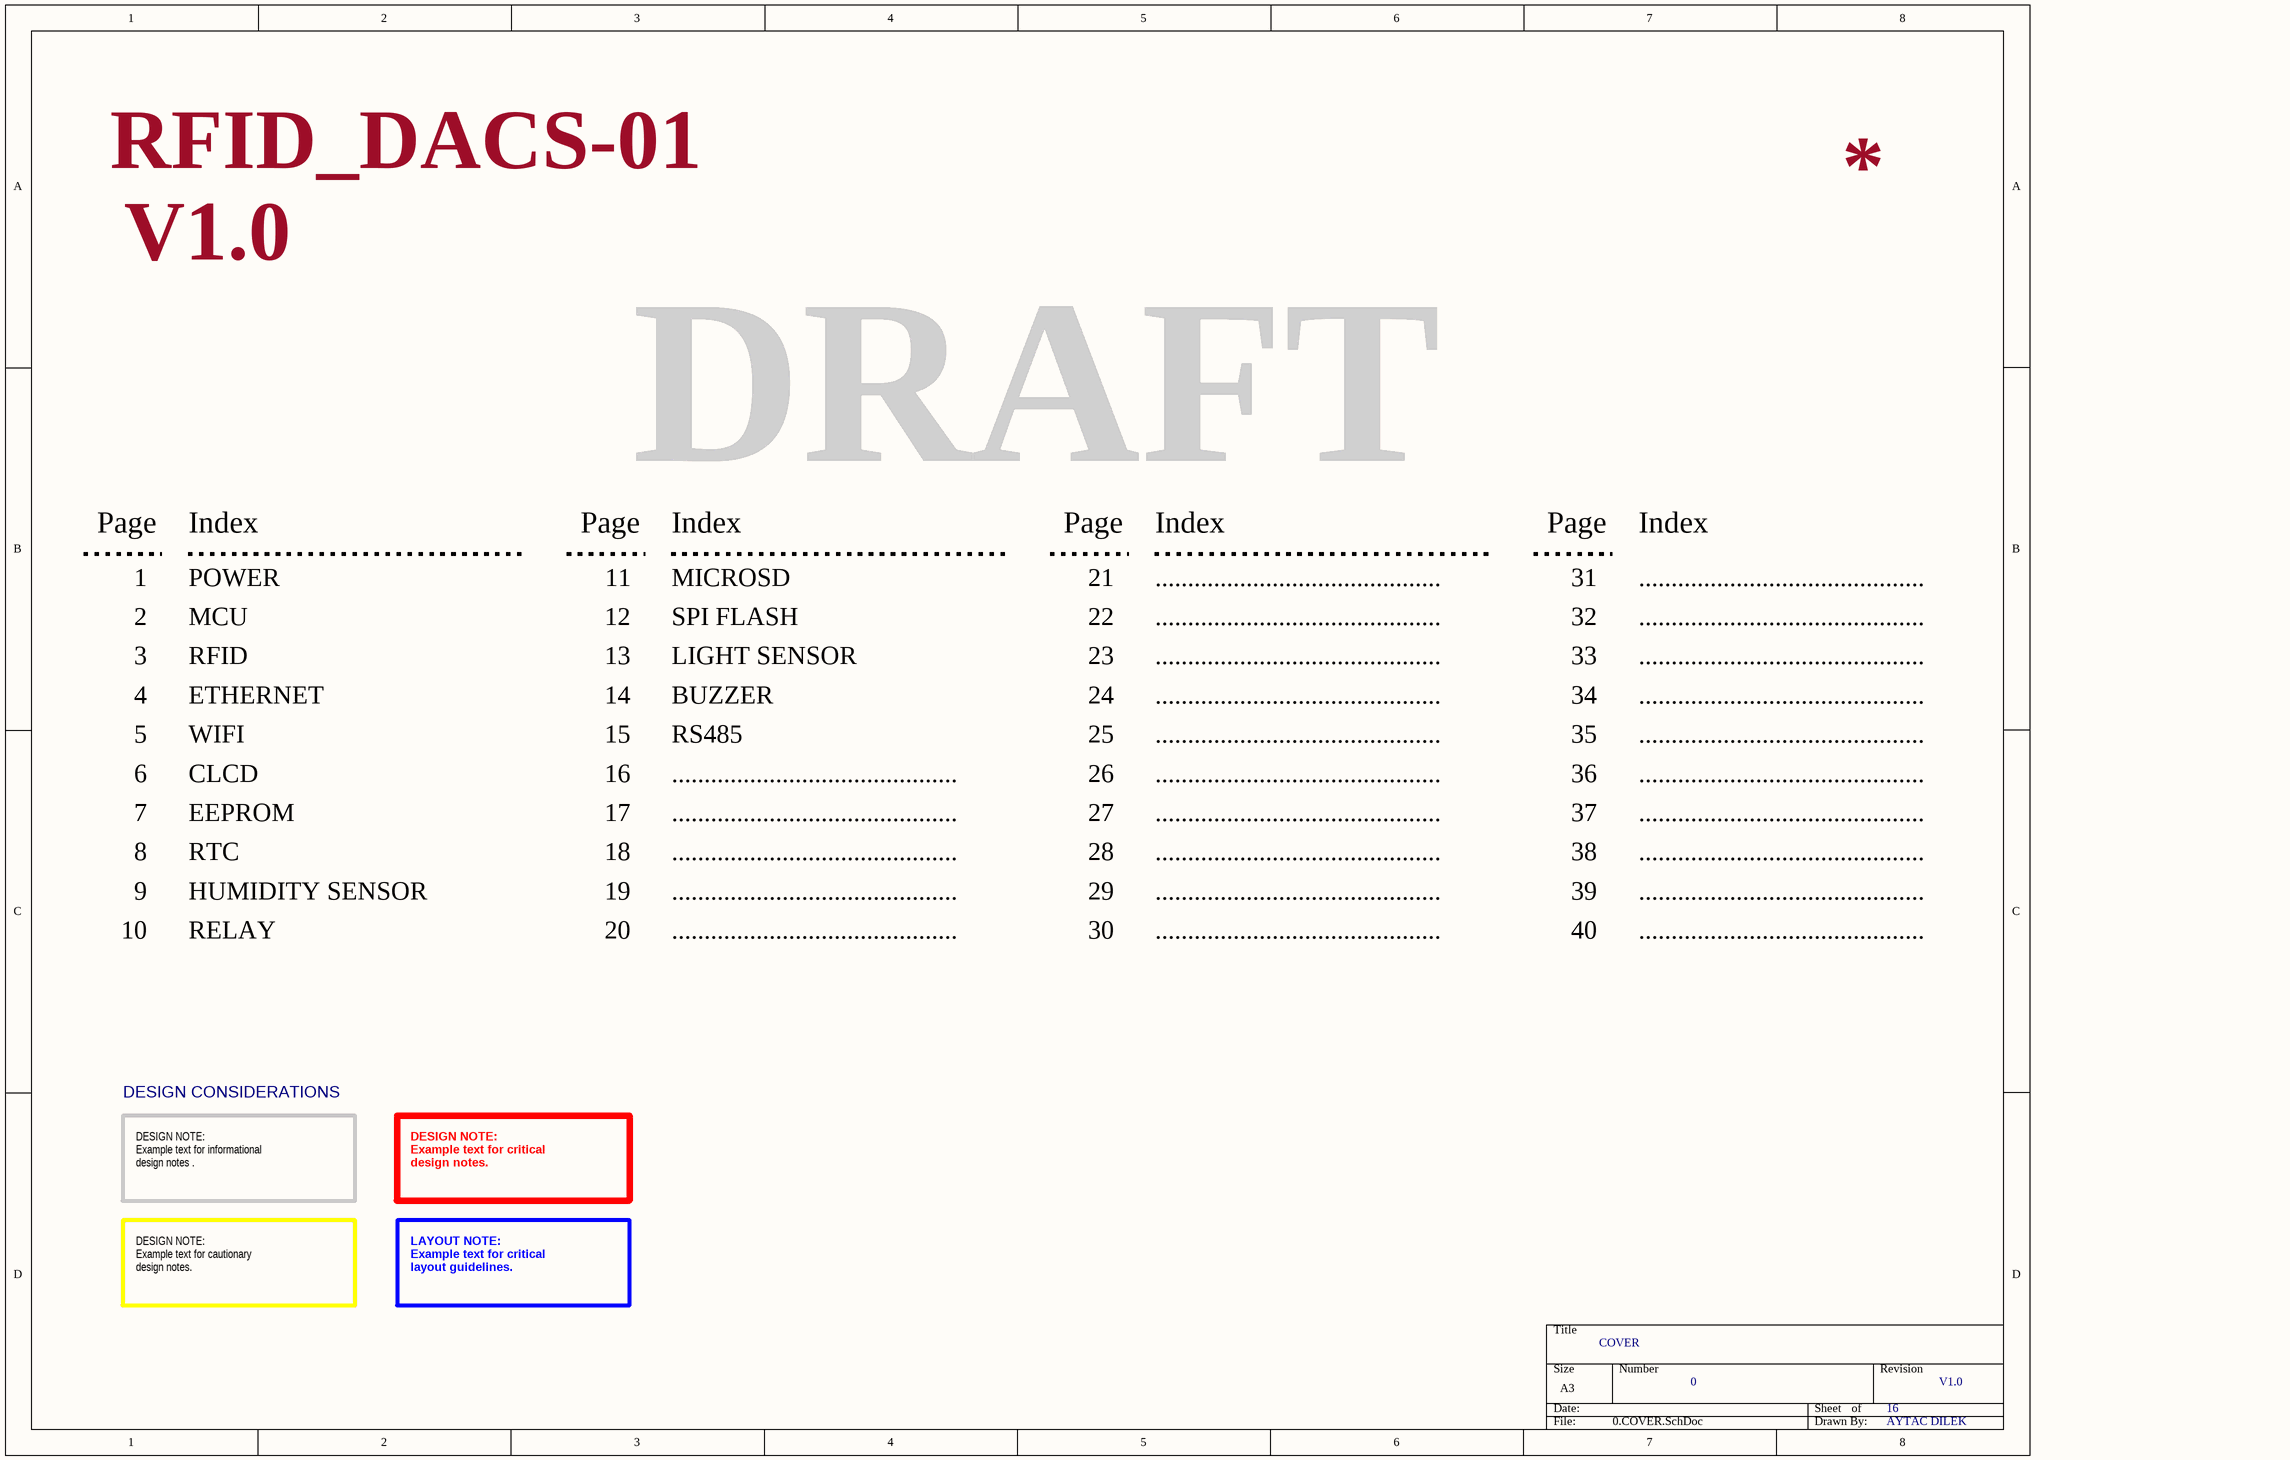
[diagram p14: 0.COVER.SchDoc]

### Notes on the sheet
- Page
- Index
- DRAFT
- 1
- 2
- POWER
- MCU
- 11
- 12
- MICROSD
- SPI FLASH
- 21
- 22
- ............................................
- 31
- 32
- 3
- RFID
- 13
- LIGHT SENSOR
- 23
- 33
- 4
- 5
- ETHERNET
- WIFI
- 14
- 15
- BUZZER
- RS485
- 24
- 25
- 34
- 35
- 6
- 7
- CLCD
- EEPROM
- 16
- 17
- 26
- 27
- 36
- 37
- 8
- RTC
- 18
- 28
- 38
- 9
- 10
- HUMIDITY SENSOR
- RELAY
- 19
- 20
- 29
- 30
- 39
- 40
- DESIGN CONSIDERATIONS
- DESIGN NOTE:
  Example text for informational
  design notes .
- DESIGN NOTE:
  Example text for critical
  design notes.
- DESIGN NOTE:
  Example text for cautionary
  design notes.
- LAYOUT NOTE:
  Example text for critical
  layout guidelines.

## Sheet 13.LIGHT.SchDoc: LIGHT SENSOR
size A; SheetNumber: 13; SheetTotal: 16
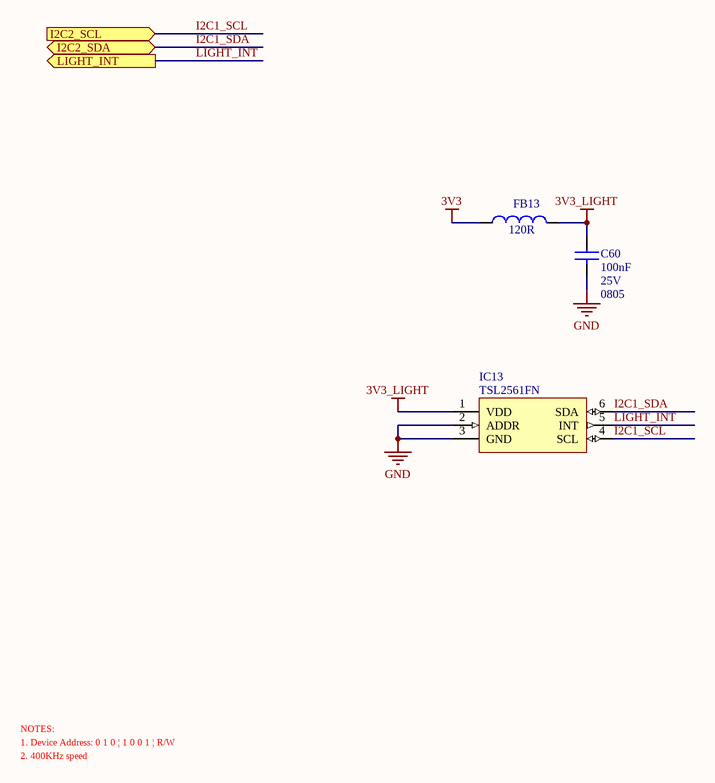
[diagram p15: 13.LIGHT.SchDoc]

### Parts
C60  Capacitance: 100nF  Voltage - Rated: 25V  Package / Case: 0805  [CAPC2012X100N_EIA0805]  (hidden comment: CAP_NP)
FB13  Impedance: 120R  [FILC2012X100N_EIA0805]  (hidden comment: BEAD)
IC13  Manufacturer Part Number: TSL2561FN  [DFN-6]  (hidden comment: TSL256x)

### Ports
I2C2_SCL (in), I2C2_SDA (bidir), LIGHT_INT (out)

### Nets
3V3: FB13.1
3V3_LIGHT: C60.1 FB13.2 IC13.1(VDD)
GND: C60.2 IC13.2(ADDR) IC13.3(GND)
I2C1_SCL: IC13.4(SCL) ; port I2C2_SCL
I2C1_SDA: IC13.6(SDA) ; port I2C2_SDA
LIGHT_INT: IC13.5(INT) ; port LIGHT_INT

### Notes on the sheet
- NOTES:
- 1. Device Address: 0 1 0 | 1 0 0 1 | R/W
- 2. 400KHz speed

### Library data of the parts
C60 = SCAP00300093: as C2 on sheet 1.POWER; Part Number: SCAP00300093; Temperature Coefficient: X7R; Operating Temperature: -55°C ~ 125°C; Mounting Type: Surface Mount, MLCC; Size / Dimension: 0.079" L x 0.049" W (2.00mm x 1.25mm); Category: Capacitors; Family: Ceramic Capacitors; Distributor Part Number: 1276-1099-1-ND; Distributor Link: http://www.digikey.com/product-detail/en/samsung-electro-mechanics-america-inc/CL21B104KACNNNC/1276-1099-1-ND/3889185; ROHS: YES; Moisture Sensitivity Level (MSL): 1 (Unlimited); Quantity: 50
FB13 = SFIL00005: as FB9-FB11 on sheet 15.RS485; Part Number: SFIL00005; Package / Case: 0805 (2012 Metric); Value: BEAD; Category: Filters; Family: Ferrite Beads and Chips; Distributor Part Number: 240-2393-1-ND; ROHS: YES; Datasheet Link: http://www.digikey.com/product-detail/en/HI0805O121R-10/240-2393-1-ND/806753; Quantity: 50
IC13 = SSEN00013: IC LIGHT TO DGTL CONV 6-DFN; Manufacturer: AMS-TAOS USA Inc.; Value: TSL2561FN; Voltage: 2.7 V ~ 3.6 V; Output Type: I²C; Cost x10($): 1.94700; Cost x100 ($): 1.29800; Cost x1000 ($): 1.00595; Distrubutor: DigiKey; Cost x1 ($): 2.40000; Part Number: SSEN00013; Operating Temperature: -30°C ~ 70°C; Category: Sensors, Transducers; Family: Optical Sensors - Ambient Light, IR, UV Sensors; Package / Case: 6-WDFN; Distributor Part Number: TSL2561-FNCT-ND; ROHS: YES; Distributor Link: http://www.digikey.com/product-detail/en/ams-taos-usa-inc/TSL2561FN/TSL2561-FNCT-ND/3095298; Quantity: 0

## Nets that join several sheets
3V3: 2.MCU (5 pins), 4.ETHERNET (FB1.2), 3.RFID (FB12.1), 11.MICROSD (FB5.1), 12.SPI_FLASH (FB8.1), 7.EEPROM (FB2.1), 8.RTC (FB3.1), 9.TEMP (FB4.1), 1.POWER (D4.1), 10.RELAY (R30.1 R31.1), 15.RS485 (FB9.1), 13.LIGHT (FB13.1)
5V: 6.CLCD (CN3.2 CN3.15 VR1.1), 1.POWER (6 pins), 10.RELAY (D5.1 IC7.4 REL1.2), 14.BUZZER (LS1.1)
GND: 2.MCU (23 pins), 4.ETHERNET (30 pins), 3.RFID (19 pins), 11.MICROSD (C29.2 CN4.6 CN4.9 CN4.10), 12.SPI_FLASH (C42.1 IC9.4), 6.CLCD (CN3.1 CN3.5 Q2.2 VR1.3), 7.EEPROM (6 pins), 8.RTC (6 pins), 9.TEMP (C28.1 IC6.2 IC6.7), 1.POWER (17 pins), 10.RELAY (Q1.2 R33.2), 14.BUZZER (R46.1 T1.2), 15.RS485 (6 pins), 13.LIGHT (C60.2 IC13.2 IC13.3)
BUZZER: 2.MCU (IC8.45), 14.BUZZER (R45.1)
I2C1_SCL: 2.MCU (IC8.58), 7.EEPROM (IC4.6 R55.2), 8.RTC (IC5.6), 13.LIGHT (IC13.4)
I2C1_SDA: 2.MCU (IC8.59), 7.EEPROM (IC4.5 R56.2), 8.RTC (IC5.5), 13.LIGHT (IC13.6)
I2C2_SCL: 2.MCU (IC8.29), 9.TEMP (IC6.6 R44.1)
I2C2_SDA: 2.MCU (IC8.30), 9.TEMP (IC6.1 R43.1)
LCD_D0: 2.MCU (IC8.8), 6.CLCD (CN3.7)
LCD_D1: 2.MCU (IC8.9), 6.CLCD (CN3.8)
LCD_D2: 2.MCU (IC8.10), 6.CLCD (CN3.9)
LCD_D3: 2.MCU (IC8.11), 6.CLCD (CN3.10)
LCD_D4: 2.MCU (IC8.24), 6.CLCD (CN3.11)
LCD_D5: 2.MCU (IC8.25), 6.CLCD (CN3.12)
LCD_D6: 2.MCU (IC8.37), 6.CLCD (CN3.13)
LCD_D7: 2.MCU (IC8.38), 6.CLCD (CN3.14)
LCD_EN: 2.MCU (IC8.62), 6.CLCD (CN3.6)
LCD_LED: 2.MCU (IC8.39), 6.CLCD (R36.2)
LCD_RS: 2.MCU (IC8.61), 6.CLCD (CN3.4)
LIGHT_INT: 2.MCU (IC8.57), 13.LIGHT (IC13.5)
MFRC522_IRQ: 2.MCU (IC8.40), 3.RFID (CN6.1 IC12.23)
MFRC522_RST: 2.MCU (IC8.41), 3.RFID (CN6.6 IC12.6 R51.2)
MICROSD_CS: 2.MCU (IC8.44), 11.MICROSD (CN4.2 R37.2)
RELAY: 2.MCU (IC8.54), 10.RELAY (LED2.1 R31.2)
RS485_RXD: 2.MCU (IC8.17), 15.RS485 (IC11.1)
RS485_TXD: 2.MCU (IC8.16), 15.RS485 (IC11.4 R54.1)
RTC_INT: 2.MCU (IC8.51), 8.RTC (IC5.3)
SPI1_MISO: 2.MCU (IC8.22), 4.ETHERNET (IC3.34), 11.MICROSD (CN4.7 R38.2), 12.SPI_FLASH (IC9.2)
SPI1_MOSI: 2.MCU (IC8.23), 4.ETHERNET (IC3.35), 11.MICROSD (CN4.3 R39.2), 12.SPI_FLASH (IC9.5)
SPI1_SCLK: 2.MCU (IC8.21), 4.ETHERNET (IC3.33), 11.MICROSD (CN4.5 R40.2), 12.SPI_FLASH (IC9.6)
SPI2_MISO: 2.MCU (IC8.35), 3.RFID (CN6.5 IC12.31)
SPI2_MOSI: 2.MCU (IC8.36), 3.RFID (CN6.4 IC12.30)
SPI2_SCK: 2.MCU (IC8.34), 3.RFID (CN6.3 IC12.29)
SPI2_SS: 2.MCU (IC8.33), 3.RFID (CN6.2 IC12.24)
SPI_FLASH_CS: 2.MCU (IC8.52), 12.SPI_FLASH (IC9.1)
W5500_CS: 2.MCU (IC8.20), 4.ETHERNET (IC3.32 R18.2)
W5500_INTn: 2.MCU (IC8.27), 4.ETHERNET (IC3.36 R17.2)
W5500_RST: 2.MCU (IC8.26), 4.ETHERNET (IC3.37 R13.1)